# Altium schematic sheet MAIN.SchDoc
size B; SheetNumber: 1; SheetTotal: 10
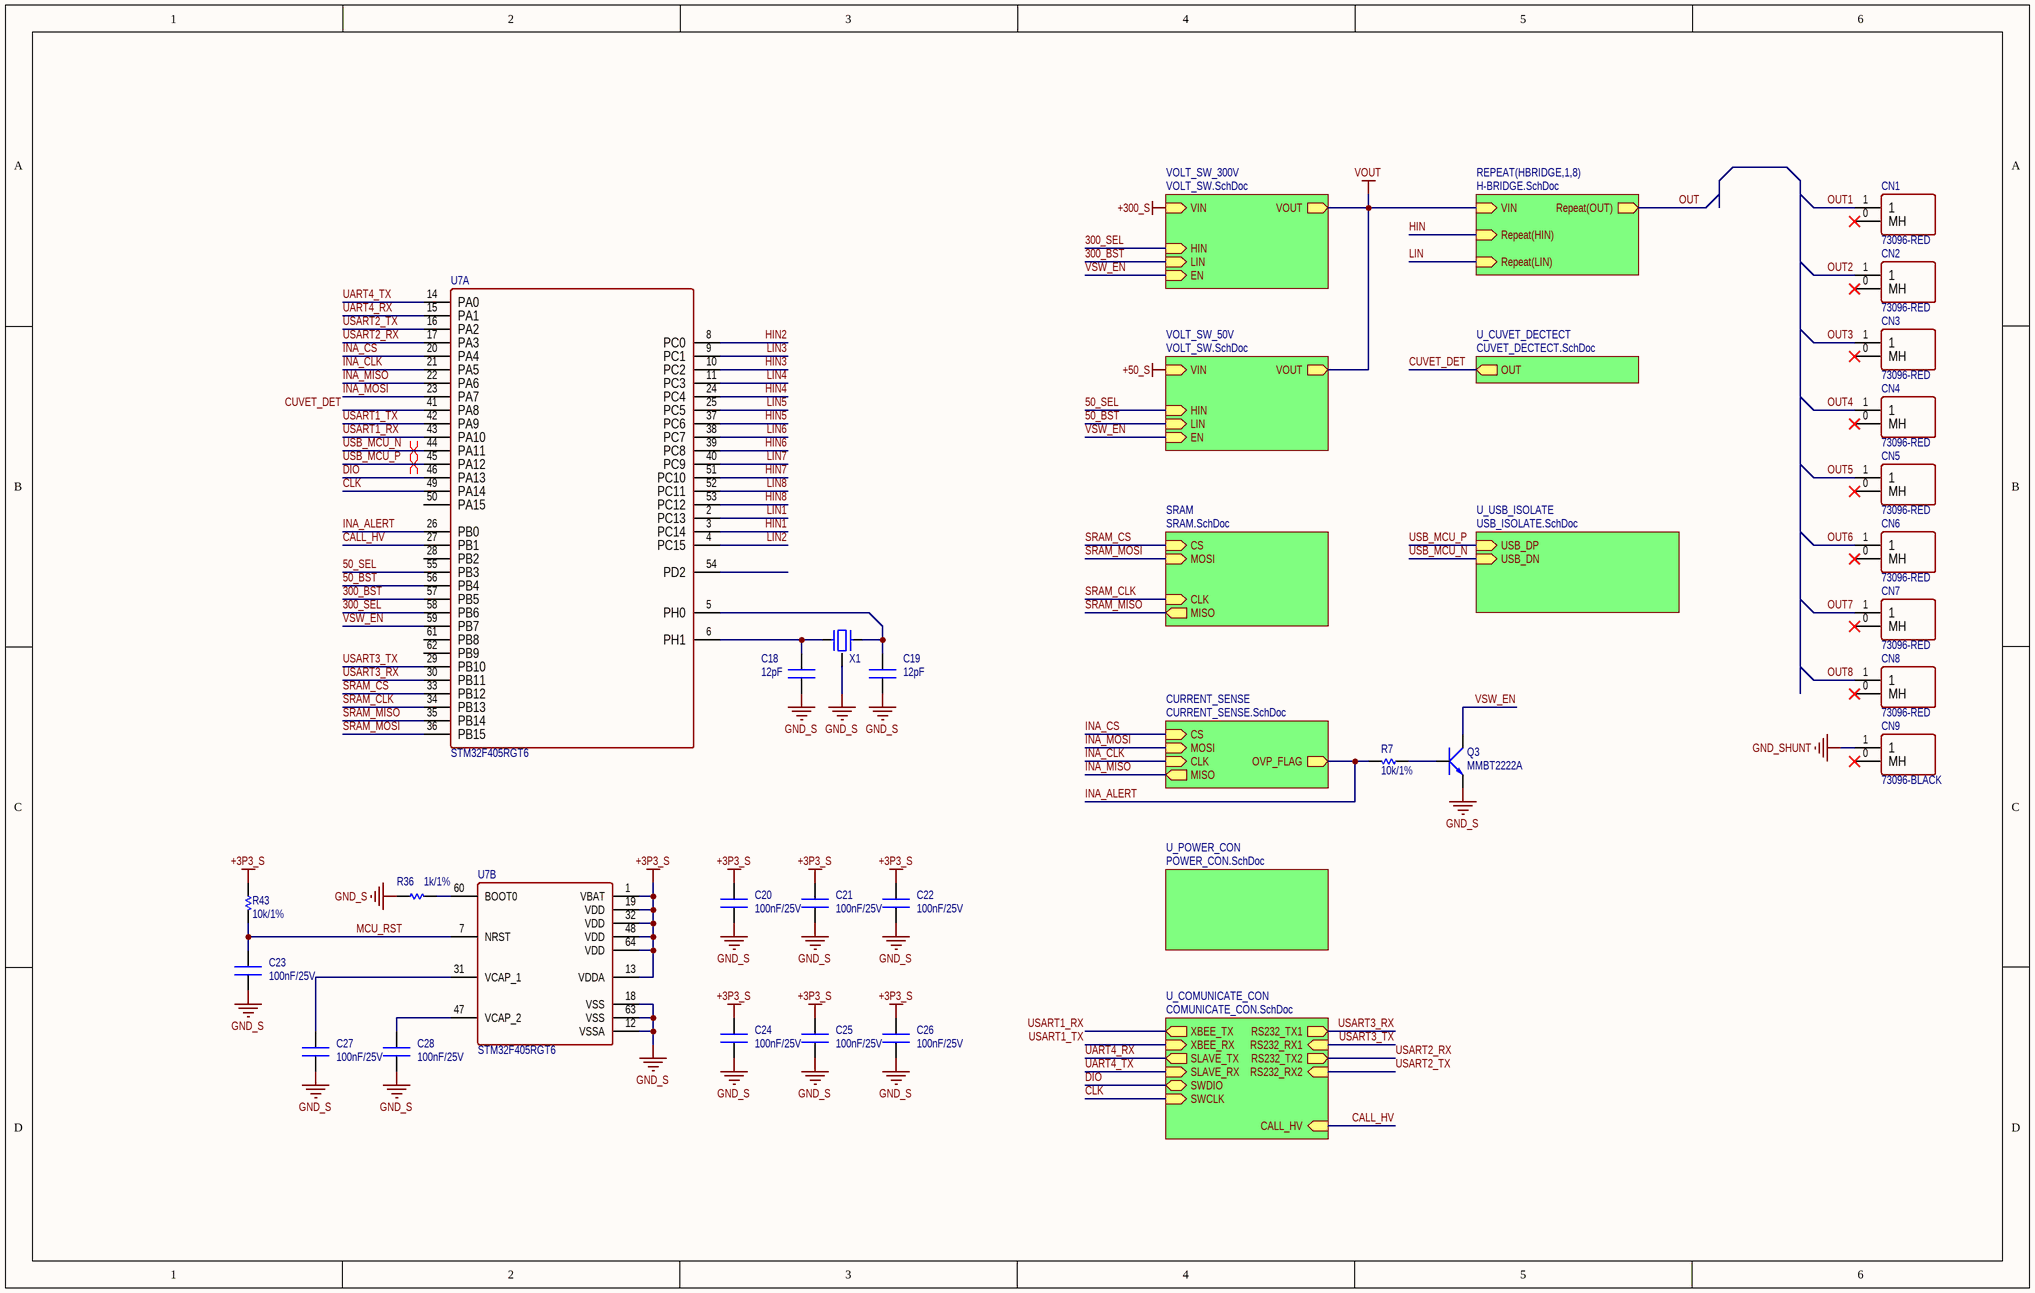
[diagram p0: MAIN.SchDoc]

## Parts
C18  12pF  [CN-SMD-0603]
C19  12pF  [CN-SMD-0603]
C20  100nF/25V  [CN-SMD-0603]
C21  100nF/25V  [CN-SMD-0603]
C22  100nF/25V  [CN-SMD-0603]
C23  100nF/25V  [CN-SMD-0603]
C24  100nF/25V  [CN-SMD-0603]
C25  100nF/25V  [CN-SMD-0603]
C26  100nF/25V  [CN-SMD-0603]
C27  100nF/25V  [CN-SMD-0603]
C28  100nF/25V  [CN-SMD-0603]
CN1  73096-RED  [73096-2-RED]
CN2  73096-RED  [73096-2-RED]
CN3  73096-RED  [73096-2-RED]
CN4  73096-RED  [73096-2-RED]
CN5  73096-RED  [73096-2-RED]
CN6  73096-RED  [73096-2-RED]
CN7  73096-RED  [73096-2-RED]
CN8  73096-RED  [73096-2-RED]
CN9  73096-BLACK  [73096-0-BLACK]
Q3  MMBT2222A  [SOT23-132]
R7  10k/1%  [RES-SMD-0603]
R36  1k/1%  [RES-SMD-0603]
R43  10k/1%  [RES-SMD-0603]
U7  STM32F405RGT6  [LQFP64]  (parts A,B of 2)
X1  ECS-80-8-33Q-ADS  [XT4-16.000MHz-4_V]  (value not drawn)

## Sub-sheets
CURRENT_SENSE = CURRENT_SENSE.SchDoc: CS (in), MOSI (in), MISO (out), CLK (in), OVP_FLAG (out)
REPEAT(HBRIDGE,1,8) = H-BRIDGE.SchDoc: Repeat(OUT) (out), Repeat(HIN) (in), Repeat(LIN) (in), VIN (in)
SRAM = SRAM.SchDoc: CS (in), MOSI (in), MISO (out), CLK (in)
U_COMUNICATE_CON = COMUNICATE_CON.SchDoc: XBEE_TX (out), XBEE_RX (in), RS232_TX1 (out), RS232_RX1 (in), SLAVE_TX (out), SWDIO (bidir), SWCLK (in), RS232_TX2 (out), RS232_RX2 (in), SLAVE_RX (in), CALL_HV (in)
U_CUVET_DECTECT = CUVET_DECTECT.SchDoc: OUT (out)
U_POWER_CON = POWER_CON.SchDoc: no entries
U_USB_ISOLATE = USB_ISOLATE.SchDoc: USB_DP (in), USB_DN (in)
VOLT_SW_50V = VOLT_SW.SchDoc: HIN (in), LIN (in), EN (in), VOUT (out), VIN (in)
VOLT_SW_300V = VOLT_SW.SchDoc: HIN (in), LIN (in), EN (in), VOUT (out), VIN (in)

## Nets
+3P3_S: C20.1 C21.1 C22.1 C24.1 C25.1 C26.1 R43.2 U7.1(VBAT) U7.13(VDDA) U7.19(VDD) U7.32(VDD) U7.48(VDD) U7.64(VDD)
+50_S: sheet VOLT_SW_50V/VIN
+300_S: sheet VOLT_SW_300V/VIN
GND_S: C18.1 C19.1 C20.2 C21.2 C22.2 C23.2 C24.2 C25.2 C26.2 C27.2 C28.2 Q3.2(E) R36.2 U7.12(VSSA) U7.18(VSS) U7.63(VSS) X1.2,4(GND)
GND_SHUNT: CN9.1
VOUT: sheet REPEAT(HBRIDGE,1,8)/VIN, sheet VOLT_SW_300V/VOUT, sheet VOLT_SW_50V/VOUT
50_BST: U7.56(PB4) ; sheet VOLT_SW_50V/LIN
50_SEL: U7.55(PB3) ; sheet VOLT_SW_50V/HIN
300_BST: U7.57(PB5) ; sheet VOLT_SW_300V/LIN
300_SEL: U7.58(PB6) ; sheet VOLT_SW_300V/HIN
CALL_HV: U7.27(PB1) ; sheet U_COMUNICATE_CON/CALL_HV
CLK: U7.49(PA14) ; sheet U_COMUNICATE_CON/SWCLK
CUVET_DET: U7.41(PA8) ; sheet U_CUVET_DECTECT/OUT
DIO: U7.46(PA13) ; sheet U_COMUNICATE_CON/SWDIO
HIN: sheet REPEAT(HBRIDGE,1,8)/Repeat(HIN)
HIN1: U7.3(PC14)
HIN2: U7.8(PC0)
HIN3: U7.10(PC2)
HIN4: U7.24(PC4)
HIN5: U7.37(PC6)
HIN6: U7.39(PC8)
HIN7: U7.51(PC10)
HIN8: U7.53(PC12)
INA_ALERT: R7.1 U7.26(PB0) ; sheet CURRENT_SENSE/OVP_FLAG
INA_CLK: U7.21(PA5) ; sheet CURRENT_SENSE/CLK
INA_CS: U7.20(PA4) ; sheet CURRENT_SENSE/CS
INA_MISO: U7.22(PA6) ; sheet CURRENT_SENSE/MISO
INA_MOSI: U7.23(PA7) ; sheet CURRENT_SENSE/MOSI
LIN: sheet REPEAT(HBRIDGE,1,8)/Repeat(LIN)
LIN1: U7.2(PC13)
LIN2: U7.4(PC15)
LIN3: U7.9(PC1)
LIN4: U7.11(PC3)
LIN5: U7.25(PC5)
LIN6: U7.38(PC7)
LIN7: U7.40(PC9)
LIN8: U7.52(PC11)
MCU_RST: C23.1 R43.1 U7.7(NRST)
OUT: sheet REPEAT(HBRIDGE,1,8)/Repeat(OUT)
OUT1: CN1.1
OUT2: CN2.1
OUT3: CN3.1
OUT4: CN4.1
OUT5: CN5.1
OUT6: CN6.1
OUT7: CN7.1
OUT8: CN8.1
SRAM_CLK: U7.34(PB13) ; sheet SRAM/CLK
SRAM_CS: U7.33(PB12) ; sheet SRAM/CS
SRAM_MISO: U7.35(PB14) ; sheet SRAM/MISO
SRAM_MOSI: U7.36(PB15) ; sheet SRAM/MOSI
UART4_RX: U7.15(PA1) ; sheet U_COMUNICATE_CON/SLAVE_TX
UART4_TX: U7.14(PA0) ; sheet U_COMUNICATE_CON/SLAVE_RX
USART1_RX: U7.43(PA10) ; sheet U_COMUNICATE_CON/XBEE_TX
USART1_TX: U7.42(PA9) ; sheet U_COMUNICATE_CON/XBEE_RX
USART2_RX: U7.17(PA3) ; sheet U_COMUNICATE_CON/RS232_TX2
USART2_TX: U7.16(PA2) ; sheet U_COMUNICATE_CON/RS232_RX2
USART3_RX: U7.30(PB11) ; sheet U_COMUNICATE_CON/RS232_TX1
USART3_TX: U7.29(PB10) ; sheet U_COMUNICATE_CON/RS232_RX1
USB_MCU_N: U7.44(PA11) ; sheet U_USB_ISOLATE/USB_DN
USB_MCU_P: U7.45(PA12) ; sheet U_USB_ISOLATE/USB_DP
VSW_EN: Q3.3(C) U7.59(PB7) ; sheet VOLT_SW_300V/EN, sheet VOLT_SW_50V/EN
NetC18_2: C18.2 U7.6(PH1) X1.3
NetC19_2: C19.2 U7.5(PH0) X1.1
NetC27_1: C27.1 U7.31(VCAP_1)
NetC28_1: C28.1 U7.47(VCAP_2)
NetQ3_1: Q3.1(B) R7.2
NetR36_1: R36.1 U7.60(BOOT0)

Not connected (* = marked no-connect by the designer): CN1 0(MH)*; CN2 0(MH)*; CN3 0(MH)*; CN4 0(MH)*; CN5 0(MH)*; CN6 0(MH)*; CN7 0(MH)*; CN8 0(MH)*; CN9 0(MH)*; U7 28(PB2) 50(PA15) 54(PD2) 61(PB8) 62(PB9)

## Layout directives
differential pair; differential pair class USB: USB_MCU_N, USB_MCU_P

## Library data of the parts
C18 C19 = CN: CL10C120JB81PNC; PN: CL10C120JB81PNC
C20-C28 = CN: CL10B104KA8NNNC; PN: CL10B104KA8NNNC
CN1-CN8 = BANANA: Banana connector; PN: 73096-2-RED
CN9 = BANANA: Banana connector; PN: 73096-2-BLACK
Q3 = 2SC1815: PN: MMBT2222A
R7 R43 = Res-SMD: ERJ-3EKF1002V; Manufacturer: Generic Components; Class: Passive; PN: ERJ-3EKF1002V; Publisher: Altium Hobart Technology Centre
R36 = Res-SMD: ERJ-3EKF1001V; Manufacturer: Generic Components; Class: Passive; PN: ERJ-3EKF1001V; Publisher: Altium Hobart Technology Centre
U7 = STM32F405RGT6: High-performance foundation line, ARM Cortex-M4 core with DSP and FPU, 1 Mbyte Flash, 168 MHz CPU, ART Accelerator; PN: STM32F405RGT6
X1 = XT4: PN: ECS-80-8-33Q-ADS